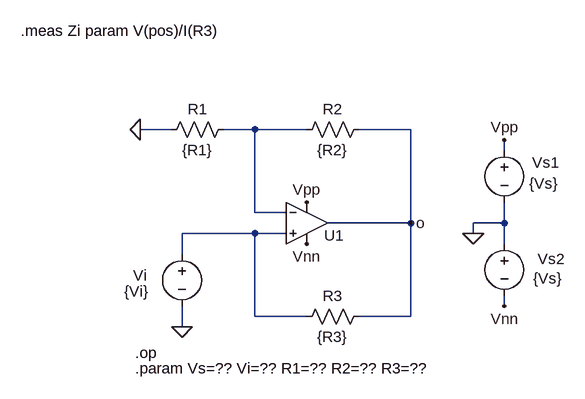
[diagram p0: schematic Amp06opFig.asc]
Amp06opFig.asc, the LTspice schematic file:
Version 4
SHEET 1 968 680
WIRE -48 80 -96 80
WIRE 80 80 32 80
WIRE 160 80 80 80
WIRE 320 80 240 80
WIRE 464 112 464 96
WIRE 80 208 80 80
WIRE 128 208 80 208
WIRE 320 224 320 80
WIRE 320 224 192 224
WIRE 464 224 464 192
WIRE 464 224 416 224
WIRE 80 240 -32 240
WIRE 128 240 80 240
WIRE 416 240 416 224
WIRE 464 256 464 224
WIRE -32 272 -32 240
WIRE 464 352 464 336
WIRE 80 368 80 240
WIRE 160 368 80 368
WIRE 320 368 320 224
WIRE 320 368 240 368
WIRE -32 384 -32 352
FLAG 464 96 Vpp
FLAG 416 240 0
FLAG 464 352 Vnn
FLAG 160 192 Vpp
FLAG 160 256 Vnn
FLAG -32 384 0
FLAG 320 224 o
FLAG -96 80 0
SYMBOL voltage 464 96 R0
WINDOW 123 0 0 Left 0
WINDOW 39 0 0 Left 0
WINDOW 0 43 35 Left 2
WINDOW 3 38 67 Left 2
SYMATTR InstName Vs1
SYMATTR Value {Vs}
SYMBOL voltage 464 240 R0
WINDOW 123 0 0 Left 0
WINDOW 39 0 0 Left 0
WINDOW 0 51 39 Left 2
WINDOW 3 44 69 Left 2
SYMATTR InstName Vs2
SYMATTR Value {Vs}
SYMBOL voltage -32 256 R0
WINDOW 3 -89 73 Left 2
WINDOW 123 0 0 Left 0
WINDOW 39 0 0 Left 0
WINDOW 0 -75 49 Left 2
SYMATTR Value {Vi}
SYMATTR InstName Vi
SYMBOL Opamps\\UniversalOpamp2 160 224 R0
WINDOW 0 27 19 Left 2
SYMATTR InstName U1
SYMBOL res -64 96 R270
WINDOW 0 32 56 VTop 2
WINDOW 3 0 56 VBottom 2
SYMATTR InstName R1
SYMATTR Value {R1}
SYMBOL res 144 96 R270
WINDOW 0 32 56 VTop 2
WINDOW 3 0 56 VBottom 2
SYMATTR InstName R2
SYMATTR Value {R2}
SYMBOL res 144 384 R270
WINDOW 0 32 56 VTop 2
WINDOW 3 0 56 VBottom 2
SYMATTR InstName R3
SYMATTR Value {R3}
TEXT -104 448 Left 2 !.param Vs=?? Vi=?? R1=?? R2=?? R3=??
TEXT -104 424 Left 2 !.op
TEXT -280 -72 Left 2 !.meas Zi param V(pos)/I(R3)

The netlist it stands for:
* Amp06opFig.asc
Vs1 Vpp 0 {Vs}
Vs2 0 Vnn {Vs}
Vi N002 0 {Vi}
XU1 N002 N001 Vpp Vnn o level.2 Avol=1Meg GBW=10Meg Slew=10Meg ilimit=25m rail=0 Vos=0 phimargin=45 en=0 enk=0 in=0 ink=0 Rin=500Meg  ; pins IN+ IN- V+ V- OUT
R1 0 N001 {R1}
R2 N001 o {R2}
R3 N002 o {R3}
.param Vs=?? Vi=?? R1=?? R2=?? R3=??
.op
.meas Zi param V(pos)/I(R3)
.lib UniversalOpamps2.sub
.backanno
.end